# Altium schematic sheet OSP_Carrier_V8_FM-ExG.SchDoc: OSP_Carrier_V8
size B; ApprovedBy: HARI; Engineer: LP; Organization: THE_Lab; DocumentNumber: 1; Revision: 1; SheetNumber: 1; SheetTotal: 1
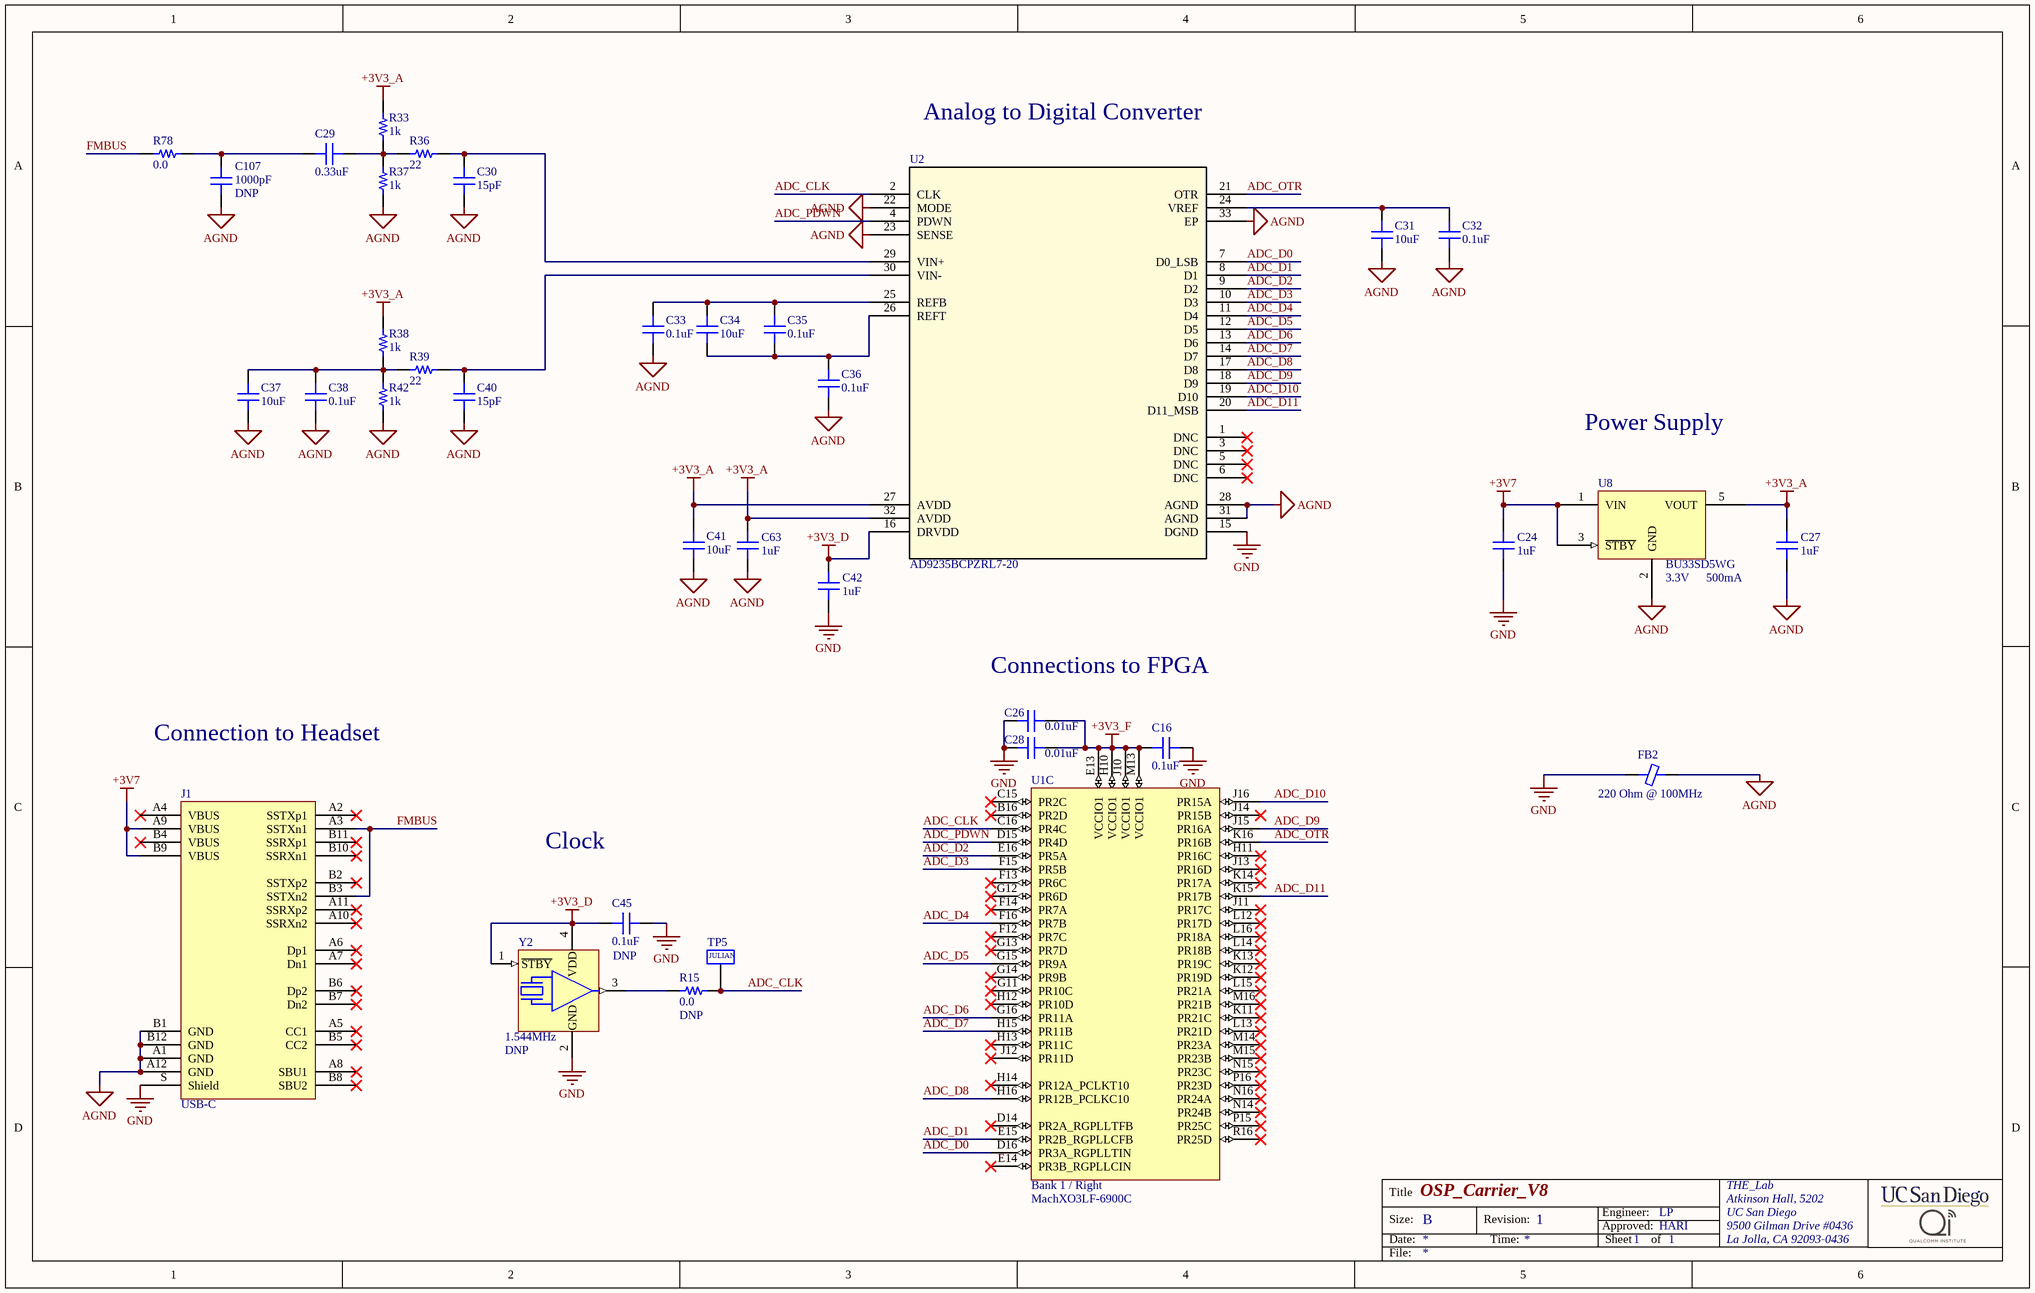
[diagram p0: OSP_Carrier_V8_FM-ExG.SchDoc]

## Parts
C16  0.1uF  [CAP 0402/1005]
C24  1uF  [CAP 0402/1005]
C26  0.01uF  [CAP 0402/1005]
C27  1uF  [CAP 0402/1005]
C28  0.01uF  [CAP 0402/1005]
C29  0.33uF  [CAP 0402/1005]
C30  15pF  [CAP 0402/1005]
C31  10uF  [CAP 0805/2012]
C32  0.1uF  [CAP 0402/1005]
C33  0.1uF  [CAP 0402/1005]
C34  10uF  [CAP 0805/2012]
C35  0.1uF  [CAP 0402/1005]
C36  0.1uF  [CAP 0402/1005]
C37  10uF  [CAP 0805/2012]
C38  0.1uF  [CAP 0402/1005]
C40  15pF  [CAP 0402/1005]
C41  10uF  [CAP 0805/2012]
C42  1uF  [CAP 0402/1005]
C45  0.1uF  [CAP 0402/1005]
C63  1uF  [CAP 0402/1005]
C107  1000pF  [CAP 0805/2012]
FB2  220 Ohm @ 100MHz  [FER 0402/1005]
J1  USB-C  [TE_USB-C_2129691-1]
R15  0.0  [RES 0603/1608]
R33  1k  [RES 0402/1005]
R36  22  [RES 0402/1005]
R37  1k  [RES 0402/1005]
R38  1k  [RES 0402/1005]
R39  22  [RES 0402/1005]
R42  1k  [RES 0402/1005]
R78  0.0  [RES 0805/2012]
TP5  TP_SMD_JULIAN  [TP_SMD_JULIAN]  (value not drawn)
U1  MachXO3LF-6900C  [LCMXO3_caBGA_BG256]  (part C of 7)
U2  AD9235BCPZRL7-20  [CP_32_2-M]
U8  BU33SD5WG  VOLTAGE: 3.3V  CURRENT: 500mA  [ROHM_SSOP5]
Y2  1.544MHz  [ABRACON_ASFLMB]

## Nets
+3V3_A: C27.1 C41.2 C63.1 R33.2 R38.2 U2.27(AVDD) U2.32(AVDD) U8.5(VOUT)
+3V3_D: C42.1 C45.2 U2.16(DRVDD) Y2.1(~{STBY}) Y2.4(VDD)
+3V3_F: C16.2 C26.1 C28.1 U1.E13(VCCIO1) U1.H10(VCCIO1) U1.J10(VCCIO1) U1.M13(VCCIO1)
+3V7: C24.1 J1.A9(VBUS) J1.B9(VBUS) U8.1(VIN) U8.3(~{STBY})
AGND: C27.2 C30.1 C31.1 C32.2 C33.2 C36.2 C37.1 C38.2 C40.1 C41.1 C63.2 C107.1 FB2.2 J1.A1(GND) J1.A12(GND) J1.B1(GND) J1.B12(GND) R37.1 R42.1 U2.22(MODE) U2.23(SENSE) U2.28(AGND) U2.31(AGND) U2.33(EP) U8.2(GND)
GND: C16.1 C24.2 C26.2 C28.2 C42.2 C45.1 FB2.1 J1.S(Shield) U2.15(DGND) Y2.2(GND)
ADC_CLK: R15.1 TP5.1 U1.C16(PR4C) U2.2(CLK)
ADC_D0: U1.D16(PR3A_RGPLLTIN) U2.7(D0_LSB)
ADC_D1: U1.E15(PR2B_RGPLLCFB) U2.8(D1)
ADC_D2: U1.E16(PR5A) U2.9(D2)
ADC_D3: U1.F15(PR5B) U2.10(D3)
ADC_D4: U1.F16(PR7B) U2.11(D4)
ADC_D5: U1.G15(PR9A) U2.12(D5)
ADC_D6: U1.G16(PR11A) U2.13(D6)
ADC_D7: U1.H15(PR11B) U2.14(D7)
ADC_D8: U1.H16(PR12B_PCLKC10) U2.17(D8)
ADC_D9: U1.J15(PR16A) U2.18(D9)
ADC_D10: U1.J16(PR15A) U2.19(D10)
ADC_D11: U1.K15(PR17B) U2.20(D11_MSB)
ADC_OTR: U1.K16(PR16B) U2.21(OTR)
ADC_PDWN: U1.D15(PR4D) U2.4(PDWN)
FMBUS: J1.A3(SSTXn1) J1.B3(SSTXn2) R78.1
NetC29_1: C29.1 C107.2 R78.2
NetC29_2: C29.2 R33.1 R36.1 R37.2
NetC30_2: C30.2 R36.2 U2.29(VIN+)
NetC31_2: C31.2 C32.1 U2.24(VREF)
NetC33_1: C33.1 C34.2 C35.1 U2.25(REFB)
NetC34_1: C34.1 C35.2 C36.1 U2.26(REFT)
NetC37_2: C37.2 C38.1 R38.1 R39.1 R42.2
NetC40_2: C40.2 R39.2 U2.30(VIN-)
NetR15_2: R15.2 Y2.3(OUT)

Not connected (* = marked no-connect by the designer): J1 A2(SSTXp1)* A4(VBUS)* A5(CC1)* A6(Dp1)* A7(Dn1)* A8(SBU1)* A10(SSRXn2)* A11(SSRXp2)* B2(SSTXp2)* B4(VBUS)* B5(CC2)* B6(Dp2)* B7(Dn2)* B8(SBU2)* B10(SSRXn1)* B11(SSRXp1)*; U1 B16(PR2D)* C15(PR2C)* D14(PR2A_RGPLLTFB)* E14(PR3B_RGPLLCIN)* F12(PR7C)* F13(PR6C)* F14(PR7A)* G11(PR10C)* G12(PR6D)* G13(PR7D)* G14(PR9B)* H11(PR16C)* H12(PR10D)* H13(PR11C)* H14(PR12A_PCLKT10)* J11(PR17C)* J12(PR11D)* J13(PR16D)* J14(PR15B)* K11(PR21C)* K12(PR19D)* K13(PR19C)* K14(PR17A)* L12(PR17D)* L13(PR21D)* L14(PR18B)* L15(PR21A)* L16(PR18A)* M14(PR23A)* M15(PR23B)* M16(PR21B)* N14(PR24B)* N15(PR23C)* N16(PR24A)* P15(PR25C)* P16(PR23D)* R16(PR25D)*; U2 1(DNC)* 3(DNC)* 5(DNC)* 6(DNC)*

## Notes on the sheet
- Analog to Digital Converter
- Power Supply
- (near C26) Connections to FPGA
- Connection to Headset
- Clock
- Title
- Size:
- Date:
- B
- Revision:
- Time:
- Engineer:
- Approved:
- Sheet
- of
- THE_Lab
- Atkinson Hall, 5202
- UC San Diego
- 9500 Gilman Drive #0436
- La Jolla, CA 92093-0436
- File:
- (in symbol LCMXO3LF-6900C-XBG256X, part C) Bank 1 / Right
- (in symbol TP_SMD_JULIAN) JULIAN

## Library data of the parts
C16 C32 C33 C35 C36 C38 C45 = C1005X7R1H104K050BB: CAP CER 0.1UF 50V X7R 0402; Manufacturer: TDK Corporation; TemperatureRange: -55C ~ 125C; Tolerance: 10%; Value: 0.1uF; Part Number: C1005X7R1H104K050BB; PartId: 3860; Supplier 1: Digi-Key; Supplier Part Number 1: 445-5932-2-ND; ComponentLink1Description: Datasheet; ComponentLink1URL: https://product.tdk.com/info/en/catalog/datasheets/mlcc_commercial_general_en.pdf; ComponentLink2Description: Digi-Key listing; ComponentLink2URL: http://digikey.com/product-detail/en/C1005X7R1H104K050BB/445-5932-2-ND/2443410; TemperatureCoefficient: X7R; Voltage: 50V; Price: 0.0287; Type: -; Device Package: 0402 (1005 Metric)
  C45: DNP: DNP
C24 C27 C29 C42 C63 = GRM155R61A105KE15D: CAP CER 1UF 10V X5R 0402; Manufacturer: Murata Electronics North America; TemperatureRange: -55C ~ 85C; Tolerance: 10%; Part Number: GRM155R61A105KE15D; PartId: 12338; Supplier 1: Digi-Key; Supplier Part Number 1: 490-3890-2-ND; ComponentLink1Description: Datasheet; ComponentLink1URL: http://www.murata.com/~/media/webrenewal/support/library/catalog/products/capacitor/mlcc/c02e.pdf; ComponentLink2Description: Digi-Key Listing; ComponentLink2URL: https://www.digikey.com/product-detail/en/murata-electronics-north-america/GRM155R61A105KE15D/490-3890-2-ND/965904; TemperatureCoefficient: X5R; Voltage: 10V; Price: 0.0069; Device Package: 0402 (1005 Metric)
  C24 C27 C42 C63: Value: 1uF
  C29: Value: 0.33uF
C26 C28 = CC0402KRX7R8BB103: CAP CER 10000PF 25V X7R 0402; Manufacturer: Yageo; TemperatureRange: -55C ~ 125C; Tolerance: 10%; Value: 0.01uF; Part Number: CC0402KRX7R8BB103; PartId: 12361; Supplier 1: Digi-Key; Supplier Part Number 1: 311-1337-2-ND; ComponentLink1Description: Datasheet; ComponentLink1URL: http://www.yageo.com/documents/recent/UPY-GPHC_X7R_6.3V-to-50V_13.pdf; ComponentLink2Description: Digi-Key Listing; ComponentLink2URL: https://www.digikey.com/product-detail/en/yageo/CC0402KRX7R8BB103/311-1337-2-ND/2103075; TemperatureCoefficient: X7R; Voltage: 25V; Price: 0.0017; Device Package: 0402 (1005 Metric)
C30 C40 = C1005C0G1H150F050BA: CAP CER 15PF 50V C0G 0402; Manufacturer: TDK Corporation; TemperatureRange: -55C ~ 125C; TemperatureCoefficient: C0G, NP0; Tolerance: 1%; Value: 15pF; Part Number: C1005C0G1H150F050BA; PartId: 3865; Supplier 1: Digi-Key; Supplier Part Number 1: 445-7007-2-ND; ComponentLink1Description: Datasheet; ComponentLink1URL: https://product.tdk.com/info/en/catalog/datasheets/mlcc_commercial_general_en.pdf; ComponentLink2Description: Digi-Key listing; ComponentLink2URL: http://digikey.com/product-detail/en/C1005C0G1H150F050BA/445-7007-2-ND/2674809; Voltage: 50V; Price: 0.1262; Type: -; Device Package: 0402 (1005 Metric)
C31 C34 C37 C41 = C2012X5R1A106M125AB: CAP CER 10UF 10V X5R 0805; Manufacturer: TDK Corporation; TemperatureRange: -55C ~ 85C; Tolerance: 20%; Value: 10uF; Part Number: C2012X5R1A106M125AB; PartId: 4520; Supplier 1: Digi-Key; Supplier Part Number 1: 445-7661-2-ND; ComponentLink1Description: Datasheet; ComponentLink1URL: https://product.tdk.com/info/en/catalog/datasheets/mlcc_commercial_general_en.pdf; ComponentLink2Description: Digi-Key listing; ComponentLink2URL: http://digikey.com/product-detail/en/C2012X5R1A106M125AB/445-7661-2-ND/2733096; TemperatureCoefficient: X5R; Voltage: 10V; Price: 0.0521; Type: -; Device Package: 0805 (2012 Metric)
C107 = C2012C0G1H102J060AA: CAP CER 1000PF 50V C0G 0805; Manufacturer: TDK Corporation; TemperatureRange: -55C ~ 125C; TemperatureCoefficient: C0G, NP0; Tolerance: 5%; Value: 1000pF; Part Number: C2012C0G1H102J060AA; PartId: 4403; Supplier 1: Digi-Key; Supplier Part Number 1: 445-1330-2-ND; ComponentLink1Description: Datasheet; ComponentLink1URL: https://product.tdk.com/info/en/catalog/datasheets/mlcc_commercial_general_en.pdf; ComponentLink2Description: Digi-Key listing; ComponentLink2URL: http://digikey.com/product-detail/en/C2012C0G1H102J060AA/445-1330-2-ND/513853; Voltage: 50V; Price: 0.0253; Type: -; Device Package: 0805 (2012 Metric); DNP: DNP
FB2 = CIM05U221NC: FERRITE CHIP 220 OHM 500MA 0402; Manufacturer: Samsung Electro-Mechanics America, Inc.; Type: Differential Mode - Single; DC Resistance: 350 mOhm Max; Part Number: CIM05U221NC; PartId: 6444; Value: 220 Ohm @ 100MHz; Supplier 1: Digi-Key; Supplier Part Number 1: 1276-6344-2-ND; ComponentLink1Description: Datasheet; ComponentLink1URL: http://www.samsungsem.com/kr/front/downloadcms.do?path=/kr/support/product-search/bead/__icsFiles/afieldfile/2014/11/13&fileName=S_CIM05J102NC.pdf; ComponentLink2Description: Digi-Key listing; ComponentLink2URL: http://digikey.com/product-detail/en/CIM05U221NC/1276-6344-2-ND/3973776; Price: 0.0073; Device Package: 0402 (1005 Metric); Current Rating: 500mA
J1 = TE_USB_C_2129691-1: TE 2129691-1 USB-C Socket
R15 = CRCW06030000Z0EAHP: RES SMD 0.0 OHM JUMPER 1/4W 0603; Manufacturer: Vishay Dale; TemperatureRange: -55C ~ 155C; PowerRating: 0.25W, 1/4W; Value: 0.0; Part Number: CRCW06030000Z0EAHP; PartId: 16113; Supplier 1: Digi-Key; Supplier Part Number 1: 541-0.0SBTR-ND; ComponentLink1Description: Datasheet; ComponentLink1URL: http://www.vishay.com/docs/20043/crcwhpe3.pdf; ComponentLink2Description: Digi-Key Listing; ComponentLink2URL: https://www.digikey.com/product-detail/en/vishay-dale/CRCW06030000Z0EAHP/541-0.0SBTR-ND/2222231; Tolerance: Jumper; Price: 0.0238; Device Package: 0603 (1608 Metric); DNP: DNP
R33 R37 R38 R42 = ERJ-2RKF1001X: RES SMD 1K OHM 1% 1/10W 0402; Manufacturer: Panasonic Electronic Components; TemperatureRange: -55C ~ 155C; TemperatureCoefficient: 100ppm/C; PowerRating: 0.1W, 1/10W; Value: 1k; Part Number: ERJ-2RKF1001X; PartId: 4; Supplier 1: Digi-Key; Supplier Part Number 1: P1.00KLTR-ND; ComponentLink1Description: Datasheet; ComponentLink1URL: http://industrial.panasonic.com/www-cgi/jvcr13pz.cgi?E+PZ+3+AOA0002+ERJ2RKF1001X+7+WW; ComponentLink2Description: Digikey listing; ComponentLink2URL: http://digikey.com/product-detail/en/ERJ-2RKF1001X/P1.00KLTR-ND/79729; Tolerance: 1%; Price: 0.0043; Type: Thick Film; Device Package: 0402 (1005 Metric)
R36 R39 = ERJ-2RKF22R0X: RES SMD 22 OHM 1% 1/10W 0402; Manufacturer: Panasonic Electronic Components; TemperatureRange: -55C ~ 155C; TemperatureCoefficient: 100ppm/C; PowerRating: 0.1W, 1/10W; Value: 22; Part Number: ERJ-2RKF22R0X; PartId: 12215; Supplier 1: Digi-Key; Supplier Part Number 1: P22.0LTR-ND; ComponentLink1Description: Datasheet; ComponentLink1URL: http://industrial.panasonic.com/www-cgi/jvcr13pz.cgi?E+PZ+3+AOA0002+ERJ2RKF22R0X+7+WW; ComponentLink2Description: Digi-Key Listing; ComponentLink2URL: https://www.digikey.com/product-detail/en/panasonic-electronic-components/ERJ-2RKF22R0X/P22.0LTR-ND/1746157; Tolerance: 1%; Price: 0.0028; Device Package: 0402 (1005 Metric)
R78 = CRCW08050000Z0EAHP: RES SMD 0.0 OHM JUMPER 1/2W 0805; Manufacturer: Vishay Dale; TemperatureRange: -55C ~ 155C; PowerRating: 0.5W, 1/2W; Value: 0.0; Part Number: CRCW08050000Z0EAHP; PartId: 16147; Supplier 1: Digi-Key; Supplier Part Number 1: 541-0.0TBTR-ND; ComponentLink1Description: Datasheet; ComponentLink1URL: http://www.vishay.com/docs/20043/crcwhpe3.pdf; ComponentLink2Description: Digi-Key Listing; ComponentLink2URL: https://www.digikey.com/product-detail/en/vishay-dale/CRCW08050000Z0EAHP/541-0.0TBTR-ND/2222316; Tolerance: Jumper; Price: 0.0356; Device Package: 0805 (2012 Metric)
TP5 = TP_SMD_JULIAN: Julian Extra-Large SMD Test Point; DNP: DNP
U1 = LCMXO3LF-6900C-XBG256X: Lattice MachXO3LF-6900C-5BG256C FPGA
U2 = AD9235BCPZRL7-20: Imported; Manufacturer_Part_Number: AD9235BCPZRL7-20; Vendor: Vendor; Value: Value; Type: Type; RefDes: Refdes
U8 = ROHM_BU33SD5WG: ROHM BU33SD5WG-TR 3.3V 500mA LDO
Y2 = ABRA_ASFLMB-1.544MHZ-LR-T: Abracon ASFLMB-1.544MHZ-LR-T; DIGIKEY_PN: 535-11006-1-ND; DNP: DNP